# EAGLE design Caneta_Provador_Logico (EAGLE 5.10)
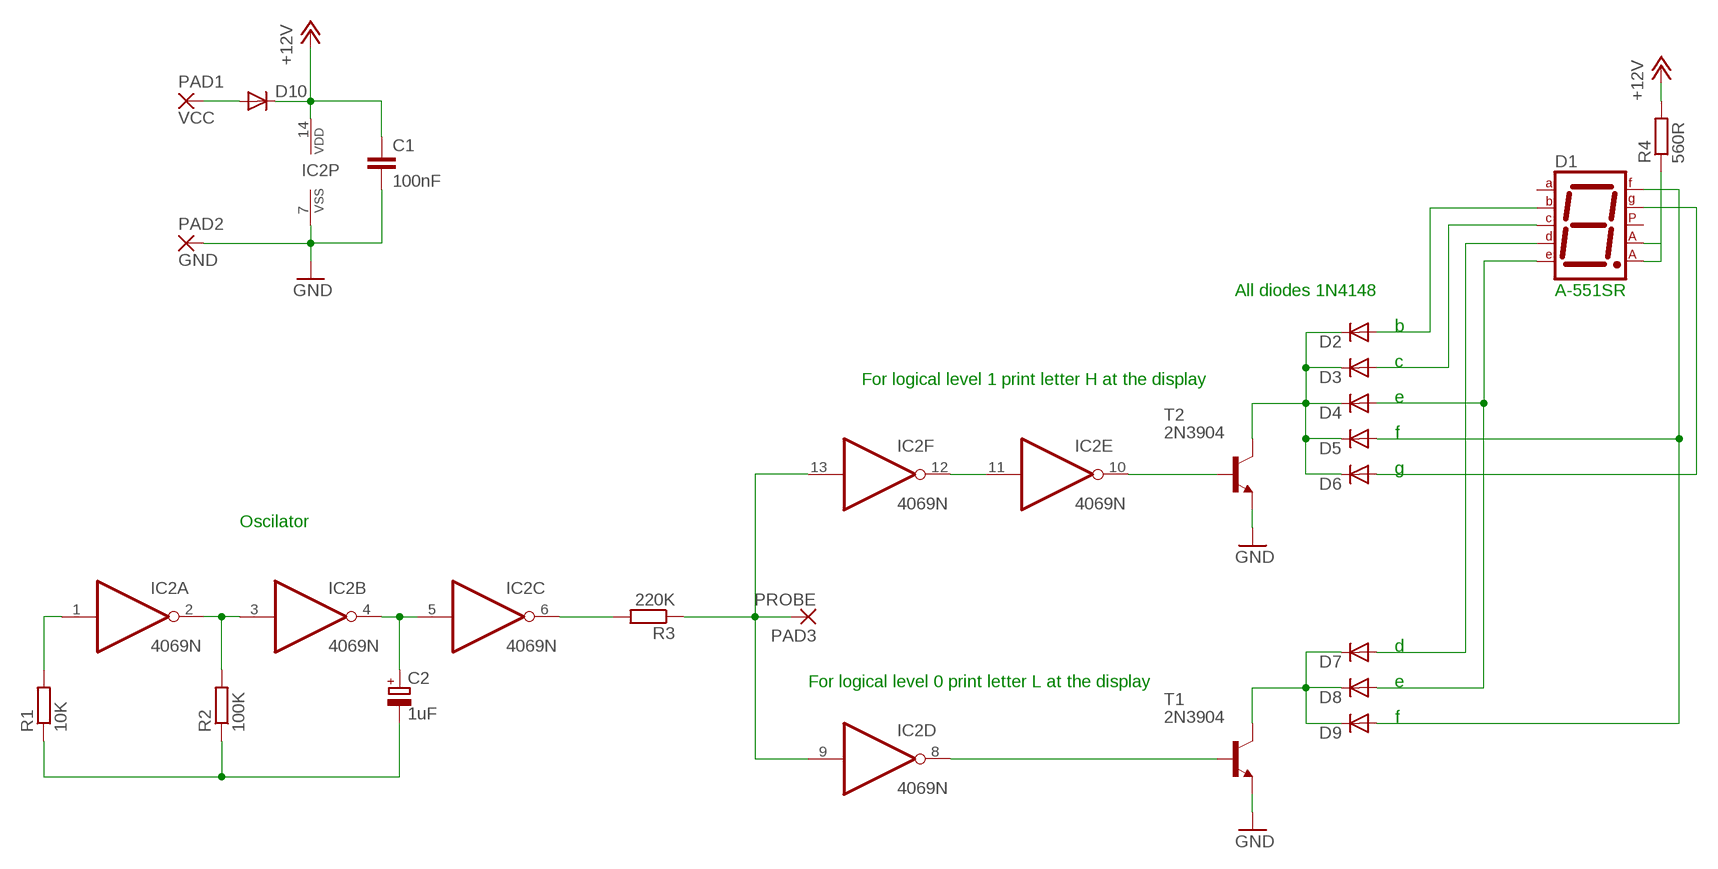
[diagram p0: schematic, sheet 1]

## Parts
C1  100nF  C-EU050-030X075  [C050-030X075]
C2  1uF  CPOL-EUE2.5-5  [E2,5-5]
D1  7SEG-CA  [7SEG-13]
D2  DIODE-D-7.5  [D-7.5]
D3  DIODE-D-7.5  [D-7.5]
D4  DIODE-D-7.5  [D-7.5]
D5  DIODE-D-7.5  [D-7.5]
D6  DIODE-D-7.5  [D-7.5]
D7  DIODE-D-7.5  [D-7.5]
D8  DIODE-D-7.5  [D-7.5]
D9  DIODE-D-7.5  [D-7.5]
D10  DIODE-D-7.5  [D-7.5]
IC2  4069N  [DIL14]
PAD1  VCC  2,54/0,8  [2,54/0,8]
PAD2  GND  2,54/0,8  [2,54/0,8]
PAD3  PROBE  2,54/0,8  [2,54/0,8]
R1  10K  R-EU_0204/7  [0204/7]
R2  100K  R-EU_0204/7  [0204/7]
R3  220K  R-EU_0204/7  [0204/7]
R4  560R  R-EU_0204/7  [0204/7]
T1  2N3904  [TO92]
T2  2N3904  [TO92]

## Nets
+12V: C1.1 D10.C IC2.14(P:VDD) R4.2
GND: C1.2 IC2.7(P:VSS) PAD2.1(P) T1.3(E) T2.3(E)
N$1: C2.- R1.1 R2.1
N$2: IC2.1(A:I) R1.2
N$3: IC2.2(A:O) IC2.3(B:I) R2.2
N$4: C2.+ IC2.4(B:O) IC2.5(C:I)
N$5: IC2.9(D:I) IC2.13(F:I) PAD3.1(P) R3.1
N$6: IC2.11(E:I) IC2.12(F:O)
N$7: IC2.10(E:O) T2.2(B)
N$8: IC2.8(D:O) T1.2(B)
N$9: D7.C D8.C D9.C T1.1(C)
N$10: D1.2(D) D7.A
N$11: D2.C D3.C D4.C D5.C D6.C T2.1(C)
N$12: D1.6(B) D2.A
N$13: D1.4(C) D3.A
N$14: D1.1(E) D4.A D8.A
N$15: D1.9(F) D5.A D9.A
N$16: D1.10(G) D6.A
N$17: IC2.6(C:O) R3.2
N$19: D10.A PAD1.1(P)
N$20: D1.3(CA1) D1.8(CA2) R4.1
Unconnected: D1.5(DP) D1.7(A)

## Notes on the sheet
- All diodes 1N4148 | A-551SR
- b
- c
- For logical level 1 print letter H at the display
- e
- f
- g
- Oscilator
- d
- For logical level 0 print letter L at the display | e
- f

## Library data of the parts
C1 = resistor:C-EU: CAPACITOR, European symbol
C2 = resistor:CPOL-EU: POLARIZED CAPACITOR, European symbol
D1 = special:7SEG-CA: 7-segment DISPLAY single anode, 13 mm
D2-D10 = diode:DIODE-: DIODE
IC2 = 40xx:4069: Hex INVERTER
PAD1-PAD3 = wirepad:2,54/0,8: THROUGH-HOLE PAD
R1-R4 = resistor:R-EU_: RESISTOR, European symbol
T1 T2 = transistor:2N3904: NPN TRANSISTOR

## Board
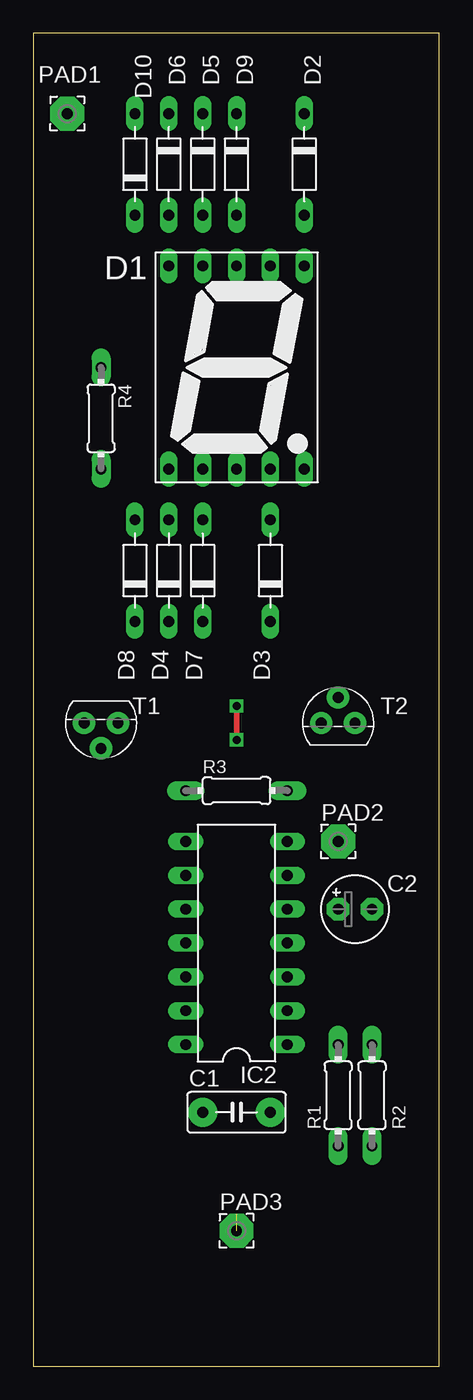
[diagram p1: board, top side]
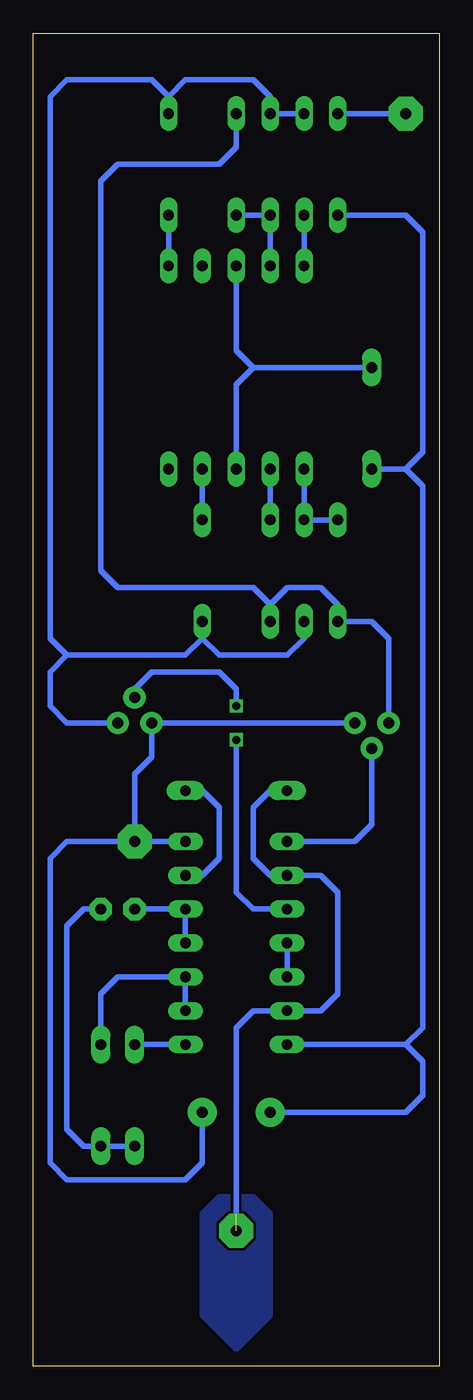
[diagram p2: board, bottom side, seen from below]

Size 30.46 x 100 mm. Coordinates in mm from the lower left corner, seen from the top.
Outline: 0,0 30.46,0 30.46,100 0,100 0,0
Copper layers (1*16): Top 0.035mm / dielectric 1.5mm / Bottom 0.035mm
Design rules "default": minimum track width 10mil, minimum drill 24mil, track to track 8mil, track to pad 8mil, pad to pad 8mil, via to via 8mil, smd to smd 8mil, copper to edge 40mil, drill to drill 8mil, minimum pad ring 10mil, minimum via ring 8mil, stop-mask expansion 4mil, vias tented up to drill 0mil, thermal gap 10mil

### Footprints (pad centres in the part's own frame; a part is rotated, then mirrored left to right if it is on the bottom)
C050-030X075 = drill 0.813 pad 2.184 round: 1 -2.54,0; 2 2.54,0
E2,5-5 = drill 0.813 pad 1.676 octagon: + -1.27,0; - 1.27,0
7SEG-13 = drill 0.813 long: 1 -5.08,-7.62; 2 -2.54,-7.62; 3 0,-7.62; 4 2.54,-7.62; 5 5.08,-7.62; 6 5.08,7.62; 7 2.54,7.62; 8 0,7.62; 9 -2.54,7.62; 10 -5.08,7.62
D-7.5 = drill 0.813 long: A 3.81,0; C -3.81,0
DIL14 = drill 0.813 long: 1 -7.62,-3.81; 2 -5.08,-3.81; 3 -2.54,-3.81; 4 0,-3.81; 5 2.54,-3.81; 6 5.08,-3.81; 7 7.62,-3.81; 8 7.62,3.81; 9 5.08,3.81; 10 2.54,3.81; 11 0,3.81; 12 -2.54,3.81; 13 -5.08,3.81; 14 -7.62,3.81
2,54/0,8 = drill 0.813 pad 2.54 octagon: 1 0,0
0204/7 = drill 0.813 pad 1.422 long: 1 -3.81,0; 2 3.81,0
TO92 = drill 0.813 pad 1.676 round: 1 1.27,0; 2 0,1.905; 3 -1.27,0

### Placement (x,y rotation side)
C1  15.24,19.05 0 top
C2  24.13,34.29 0 top
D1  15.24,74.93 0 top
D2  20.32,90.17 270 top
D3  17.78,59.69 90 top
D4  10.16,59.69 90 top
D5  12.7,90.17 270 top
D6  10.16,90.17 270 top
D7  12.7,59.69 90 top
D8  7.62,59.69 90 top
D9  15.24,90.17 270 top
D10  7.62,90.17 90 top
IC2  15.24,31.75 90 top
PAD1  2.54,93.98 0 top
PAD2  22.86,39.37 0 top
PAD3  15.24,10.16 0 top
R1  22.86,20.32 90 top
R2  25.4,20.32 90 top
R3  15.24,43.18 0 top
R4  5.08,71.12 270 top
T1  5.08,48.26 180 top
T2  22.86,48.26 0 top

### Tracks (layer width: path | path; a pad name or v marks a point on that pad's centre or on a via)
+12V
  Bottom 0.406: C1.1 2.54,19.05 1.27,20.32 1.27,22.86 2.54,24.13 | 2.54,24.13 IC2.14 | 2.54,24.13 1.27,25.4 1.27,66.04 2.54,67.31 | 2.54,67.31 R4.2 | 2.54,67.31 1.27,68.58 1.27,85.09 2.54,86.36 D10.C
GND
  Bottom 0.406: PAD2.1 IC2.7 | T1.3 T2.3 21.59,45.72 22.86,44.45 PAD2.1 | C1.2 17.78,15.24 19.05,13.97 27.94,13.97 29.21,15.24 29.21,38.1 27.94,39.37 PAD2.1
N$1
  Bottom 0.406: R1.1 R2.1 26.67,16.51 27.94,17.78 27.94,33.02 26.67,34.29 C2.-
N$2
  Bottom 0.406: IC2.1 R1.2
N$3
  Bottom 0.406: IC2.2 IC2.3 24.13,29.21 25.4,27.94 R2.2
N$4
  Bottom 0.406: IC2.4 IC2.5 C2.+
N$5  (1 unrouted)
  Bottom 0.406: R3.1 12.7,43.18 13.97,41.91 13.97,38.1 12.7,36.83 IC2.9 8.89,36.83 7.62,35.56 7.62,27.94 8.89,26.67 IC2.13 13.97,26.67 15.24,25.4 15.24,11.43
N$6
  Bottom 0.406: IC2.12 IC2.11
N$7  (via drill 0.6)
  Top 0.406: v15.24,46.99 v15.24,49.53
  Bottom 0.406: T2.2 22.86,50.8 21.59,52.07 16.51,52.07 15.24,50.8 v15.24,49.53 | v15.24,46.99 15.24,35.56 13.97,34.29 IC2.10
N$8
  Bottom 0.406: T1.2 5.08,40.64 6.35,39.37 IC2.8
N$9
  Bottom 0.406: 12.7,57.15 D7.C | 12.7,57.15 11.43,58.42 8.89,58.42 7.62,57.15 D8.C 5.08,55.88 3.81,54.61 T1.1 | 12.7,57.15 13.97,58.42 24.13,58.42 25.4,59.69 25.4,88.9 24.13,90.17 16.51,90.17 15.24,91.44 D9.C
N$10
  Bottom 0.406: D7.A D1.2
N$11
  Bottom 0.406: D6.C D5.C 12.7,95.25 13.97,96.52 19.05,96.52 20.32,95.25 | 20.32,95.25 D2.C | T2.1 27.94,48.26 29.21,49.53 29.21,52.07 27.94,53.34 | D4.C 10.16,54.61 11.43,53.34 16.51,53.34 17.78,54.61 | 17.78,54.61 D3.C | 17.78,54.61 19.05,53.34 27.94,53.34 | 27.94,53.34 29.21,54.61 29.21,95.25 27.94,96.52 21.59,96.52 20.32,95.25
N$12
  Bottom 0.406: D1.6 D2.A
N$13
  Bottom 0.406: D3.A D1.4
N$14
  Bottom 0.406: D8.A D4.A D1.1
N$15
  Bottom 0.406: D1.9 D5.A D9.A
N$16
  Bottom 0.406: D1.10 D6.A
N$17
  Bottom 0.406: R3.2 17.78,43.18 16.51,41.91 16.51,38.1 17.78,36.83 IC2.6
N$18
  pour Bottom: 15.24,1.27 12.7,3.81 12.7,11.43 13.97,12.7 16.51,12.7 17.78,11.43 17.78,3.81
N$19
  Bottom 0.406: PAD1.1 D10.A
N$20
  Bottom 0.406: D1.8 15.24,76.2 13.97,74.93 | R4.1 13.97,74.93 | D1.3 15.24,73.66 13.97,74.93